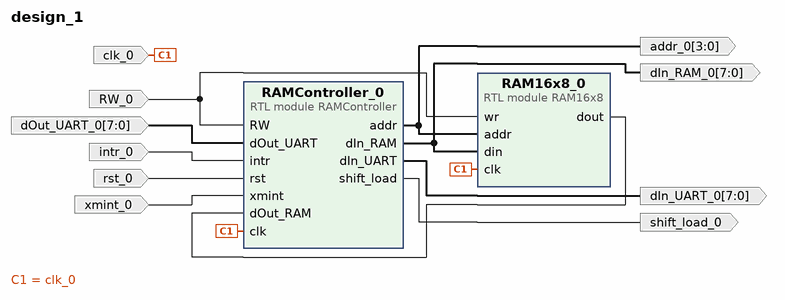
[diagram p0: block diagram of the top level]
# Vivado block design design_1, xc7z020clg400-1, Vivado 2018.3
create_bd_design design_1

create_bd_port -dir I RW_0
create_bd_port -dir O -from 3 -to 0 addr_0
create_bd_port -dir I -type clk clk_0
create_bd_port -dir O -from 7 -to 0 dIn_RAM_0
create_bd_port -dir O -from 7 -to 0 dIn_UART_0
create_bd_port -dir I -from 7 -to 0 dOut_UART_0
create_bd_port -dir I -type intr intr_0
create_bd_port -dir I -type rst rst_0
create_bd_port -dir O shift_load_0
create_bd_port -dir I xmint_0

create_bd_cell -type module -reference RAMController RAMController_0
create_bd_cell -type module -reference RAM16x8 RAM16x8_0

# ---- connections ----

connect_bd_net -net RW_0_1 [get_bd_ports RW_0] [get_bd_pins RAMController_0/RW] [get_bd_pins RAM16x8_0/wr]
connect_bd_net [get_bd_pins RAMController_0/addr] [get_bd_ports addr_0] [get_bd_pins RAM16x8_0/addr]
connect_bd_net -net clk_0_1 [get_bd_ports clk_0] [get_bd_pins RAMController_0/clk] [get_bd_pins RAM16x8_0/clk]
connect_bd_net [get_bd_pins RAMController_0/dIn_RAM] [get_bd_ports dIn_RAM_0] [get_bd_pins RAM16x8_0/din]
connect_bd_net [get_bd_pins RAMController_0/dIn_UART] [get_bd_ports dIn_UART_0]
connect_bd_net -net dOut_UART_0_1 [get_bd_ports dOut_UART_0] [get_bd_pins RAMController_0/dOut_UART]
connect_bd_net -net intr_0_1 [get_bd_ports intr_0] [get_bd_pins RAMController_0/intr]
connect_bd_net -net rst_0_1 [get_bd_ports rst_0] [get_bd_pins RAMController_0/rst]
connect_bd_net [get_bd_pins RAMController_0/shift_load] [get_bd_ports shift_load_0]
connect_bd_net -net xmint_0_1 [get_bd_ports xmint_0] [get_bd_pins RAMController_0/xmint]
connect_bd_net [get_bd_pins RAM16x8_0/dout] [get_bd_pins RAMController_0/dOut_RAM]

validate_bd_design
save_bd_design
